# EAGLE design dimmer1 (EAGLE 8.6.3)
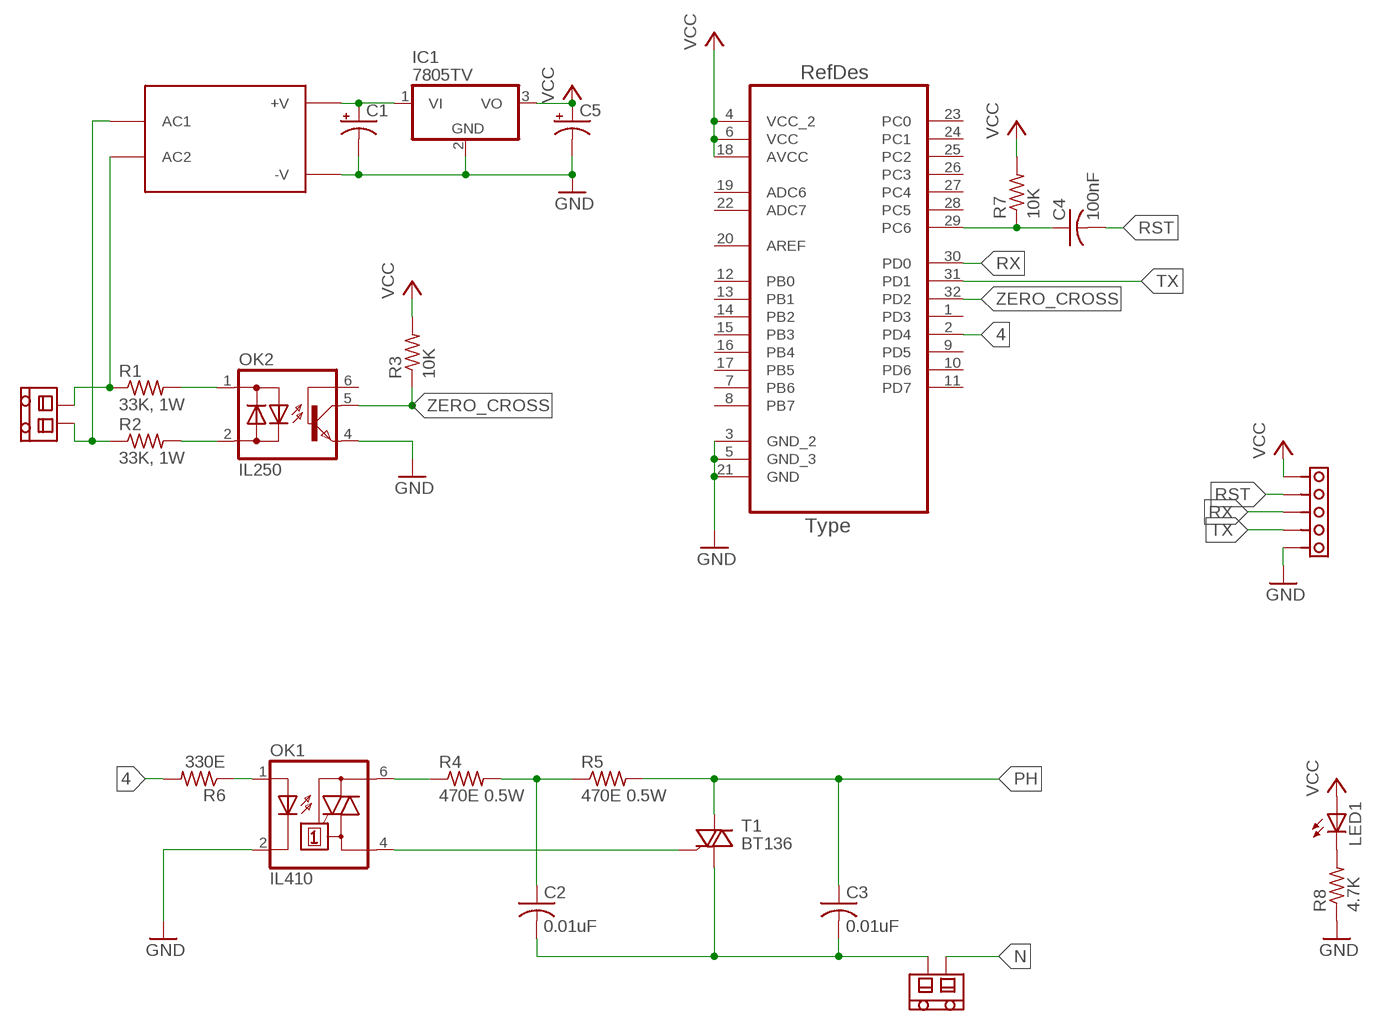
[diagram p0: schematic, sheet 1]

## Parts
C1  CPOL-US153CLV-0807  [153CLV-0807]
C2  0.01uF  C-US075-032X103  [C075-032X103]
C3  0.01uF  C-US075-032X103  [C075-032X103]
C4  100nF  C-USC1206  [C1206]
C5  CPOL-US153CLV-0807  [153CLV-0807]
IC1  7805TV  [TO220V]
LED1  LEDCHIPLED_1206  [CHIPLED_1206]
OK1  IL410  [DIL06]
OK2  IL250  [DIL06]
R1  33K, 1W  R-US_0207/10  [0207/10]
R2  33K, 1W  R-US_0207/10  [0207/10]
R3  10K  R-US_M1206  [M1206]
R4  470E 0.5W  R-US_0207/12  [0207/12]
R5  470E 0.5W  R-US_0207/12  [0207/12]
R6  330E  R-US_M1206  [M1206]
R7  10K  R-US_M1206  [M1206]
R8  4.7K  R-US_M1206  [M1206]
T1  BT136  [TO220AB]
U1  ATMEGA328P-AU  [QFP80P900X900X120-32N]
U$1  DC_ADAPTER  [DC_ADAPTER]
U$2  TERMINAL_BLOCK  [TERMINAL_BLOCK]
U$3  TERMINAL_BLOCK  [TERMINAL_BLOCK]
U$4  BERG_5  [BERG_5]

## Nets
4: R6.2 U1.2(PD4)
GND: C1.- C5.- IC1.2(GND) OK1.2(C) OK2.4(E) R8.1 U1.3(GND_2) U1.5(GND_3) U1.21(GND) U$1.V-(-V) U$4.E
N: R2.1 U$1.AC1 U$2.1 U$3.1
N$1: OK2.1(AC1) R1.2
N$2: OK1.1(A) R6.1
N$3: LED1.C R8.2
N$4: OK2.2(AC2) R2.2
N$5: C1.+ IC1.1(VI) U$1.V+(+V)
N$6: OK1.6(A2) R4.1
N$7: C2.1 R4.2 R5.1
N$8: C2.2 C3.2 T1.1(A1) U$3.2
N$9: OK1.4(A1) T1.3(G)
PH: C3.1 R1.1 R5.2 T1.2(A2) U$1.AC2 U$2.2
RS: C4.1 R7.1 U1.29(PC6)
RST: C4.2 U$4.H
RX: U1.30(PD0) U$4.G
TX: U1.31(PD1) U$4.F
VCC: C5.+ IC1.3(VO) LED1.A R3.2 R7.2 U1.4(VCC_2) U1.6(VCC) U1.18(AVCC) U$4.I
ZERO_CROSS: OK2.5(C) R3.1 U1.32(PD2)
Unconnected: OK2.6(B) U1.1(PD3) U1.7(PB6) U1.8(PB7) U1.9(PD5) U1.10(PD6) U1.11(PD7) U1.12(PB0) U1.13(PB1) U1.14(PB2) U1.15(PB3) U1.16(PB4) U1.17(PB5) U1.19(ADC6) U1.20(AREF) U1.22(ADC7) U1.23(PC0) U1.24(PC1) U1.25(PC2) U1.26(PC3) U1.27(PC4) U1.28(PC5)

## Library data of the parts
C1 C5 = rcl:CPOL-US: POLARIZED CAPACITOR, American symbol; SPICEPREFIX: C
C2-C4 = rcl:C-US: CAPACITOR, American symbol; SPICEPREFIX: C
IC1 = linear:78*: Positive VOLTAGE REGULATOR Source: http://cache.national.com/ds/LM/LM78L05.pdf http://www.fairchildsemi.com/ds/LM/LM7805.pdf
LED1 = led:LED: LED OSRAM: - CHIPLED LG R971, LG N971, LY N971, LG Q971, LY Q971, LO R971, LY R971 LH N974, LH R974 LS Q976, LO Q976, LY Q976 LO Q996 - Hyper CHIPLED LW Q18S LB Q993, LB Q99A, LB R99A - SideLED LS A670, LO A670, LY A670, LG A670, LP A670 LB A673, LV A673, LT A673, LW A673 LH A674 LY A675 LS A676, LA A676, LO A676, LY A676, LW A676 LS A679, LY A679, LG A679 - Hyper Micro SIDELED® LS Y876, LA Y876, LO Y876, LY Y876 LT Y87S - SmartLED LW L88C, LW L88S LB L89C, LB L89S, LG L890 LS L89K, LO L89K, LY L89K LS L896, LA L896, LO L896, LY L896 - TOPLED LS T670, LO T670, LY T670, LG T670, LP T670 LSG T670, LSP T670, LSY T670, LOP T670, LYG T670 LG T671, LOG T671, LSG T671 LB T673, LV T673, LT T673, LW T673 LH T674 LS T676, LA T676, LO T676, LY T676, LB T676, LH T676, LSB T676, LW T676 LB T67C, LV T67C, LT T67C, LS T67K, LO T67K, LY T67K, LW E67C LS E67B, LA E67B, LO E67B, LY E67B, LB E67C, LV E67C, LT E67C LW T67C LS T679, LY T679, LG T679 LS T770, LO T770, LY T770, LG T770, LP T770 LB T773, LV T773, LT T773, LW T773 LH T774 LS E675, LA E675, LY E675, LS T675 LS T776, LA T776, LO T776, LY T776, LB T776 LHGB T686 LT T68C, LB T68C - Hyper Mini TOPLED® LB M676 - Mini TOPLED Santana® LG M470 LS M47K, LO M47K, LY M47K Source: http://www.osram.convergy.de LUXEON: - LUMILED® LXK2-PW12-R00, LXK2-PW12-S00, LXK2-PW14-U00, LXK2-PW14-V00 LXK2-PM12-R00, LXK2-PM12-S00, LXK2-PM14-U00 LXK2-PE12-Q00, LXK2-PE12-R00, LXK2-PE12-S00, LXK2-PE14-T00, LXK2-PE14-U00 LXK2-PB12-K00, LXK2-PB12-L00, LXK2-PB12-M00, LXK2-PB14-N00, LXK2-PB14-P00, LXK2-PB14-Q00 LXK2-PR12-L00, LXK2-PR12-M00, LXK2-PR14-Q00, LXK2-PR14-R00 LXK2-PD12-Q00, LXK2-PD12-R00, LXK2-PD12-S00 LXK2-PH12-R00, LXK2-PH12-S00 LXK2-PL12-P00, LXK2-PL12-Q00, LXK2-PL12-R00 Source: www.luxeon.com KINGBRIGHT: KA-3528ASYC Source: www.kingbright.com
OK1 = optocoupler:IL410: SIEMENS OPTO COUPLER; MF: VISHAY/TELEFUNKEN; MPN: IL410; OC_FARNELL: 1045434; OC_NEWARK: 58K1715
OK2 = optocoupler:IL250: SIEMENS OPTO COUPLER; MF: VISHAY/TELEFUNKEN; MPN: IL250; OC_FARNELL: 1469559; OC_NEWARK: 58K1705
R1-R8 = rcl:R-US_: RESISTOR, American symbol; SPICEPREFIX: R
T1 = triac:BT136: Triac BT136 series E sensitive gate Source: http://www.nxp.com/acrobat_download/datasheets/BT136_SERIES_E_2.pdf
U1 = ATmega328-AU:ATMEGA328P-AU; DESCRIPTION: 8-bit Microcontroller with In-System Programmable Flash; MPN: ATMEGA328P-AU; OC_FARNELL: 1715486; OC_NEWARK: 14R4631; PACKAGE: TQFP-32; SUPPLIER: Atmel
U$1 = dragCustom:DC_ADAPTER
U$2 U$3 = dragCustom:TERMINAL_BLOCK
U$4 = dragCustom:BERG_5

## Board
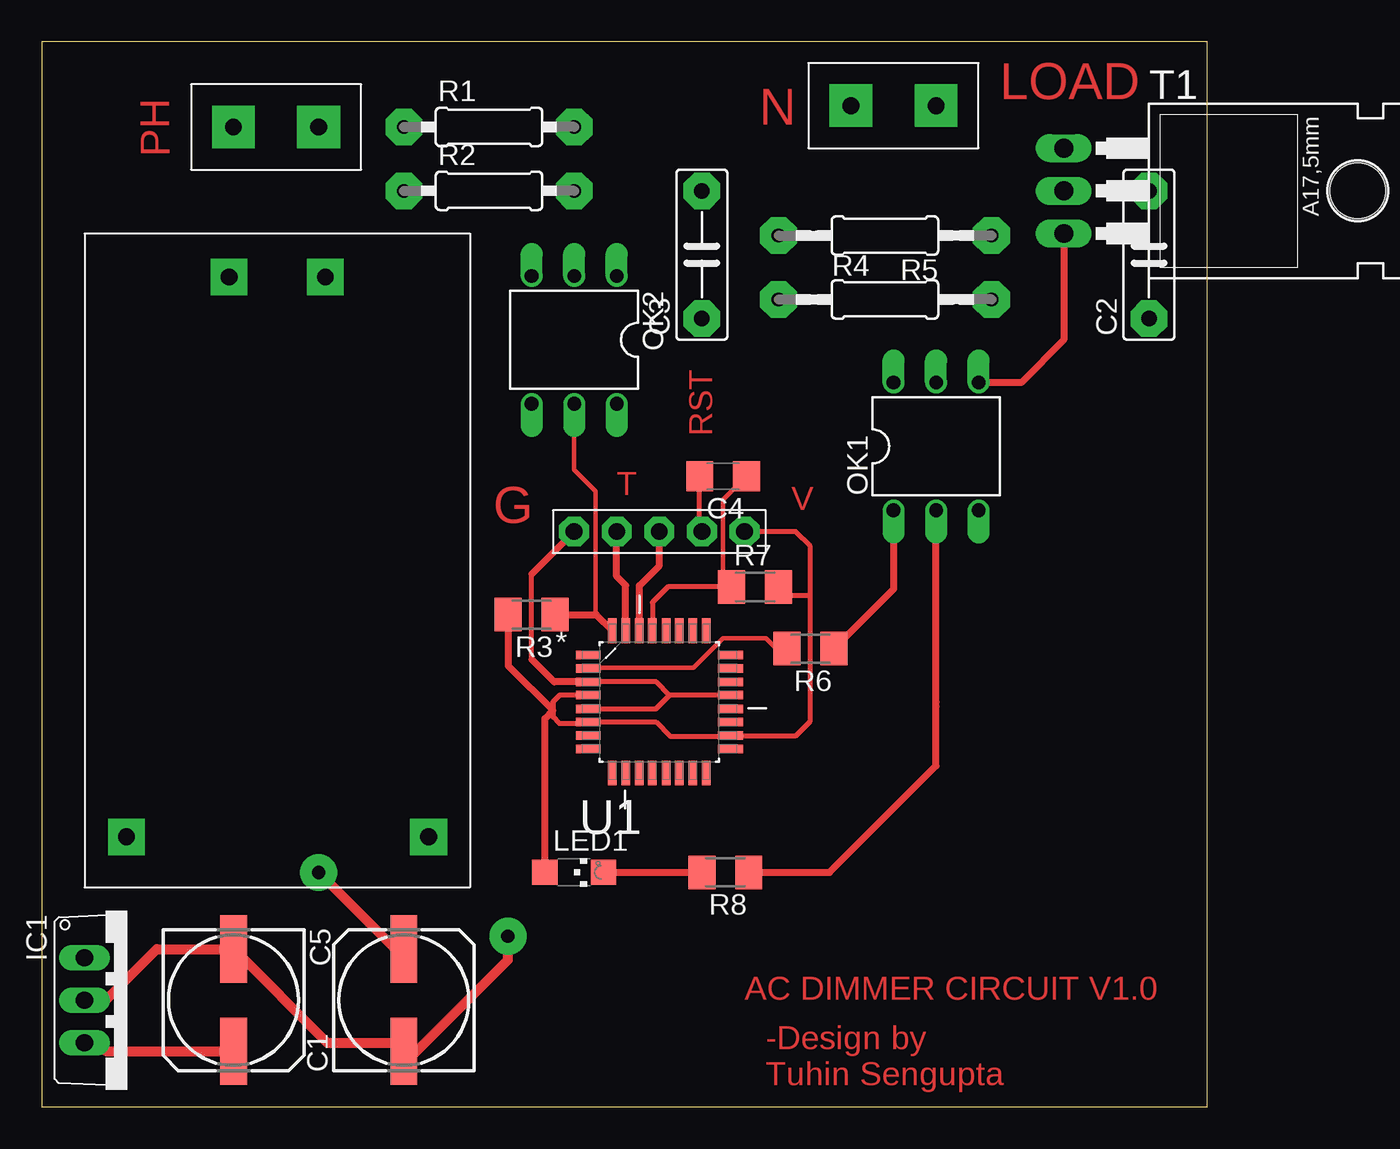
[diagram p1: board, top side]
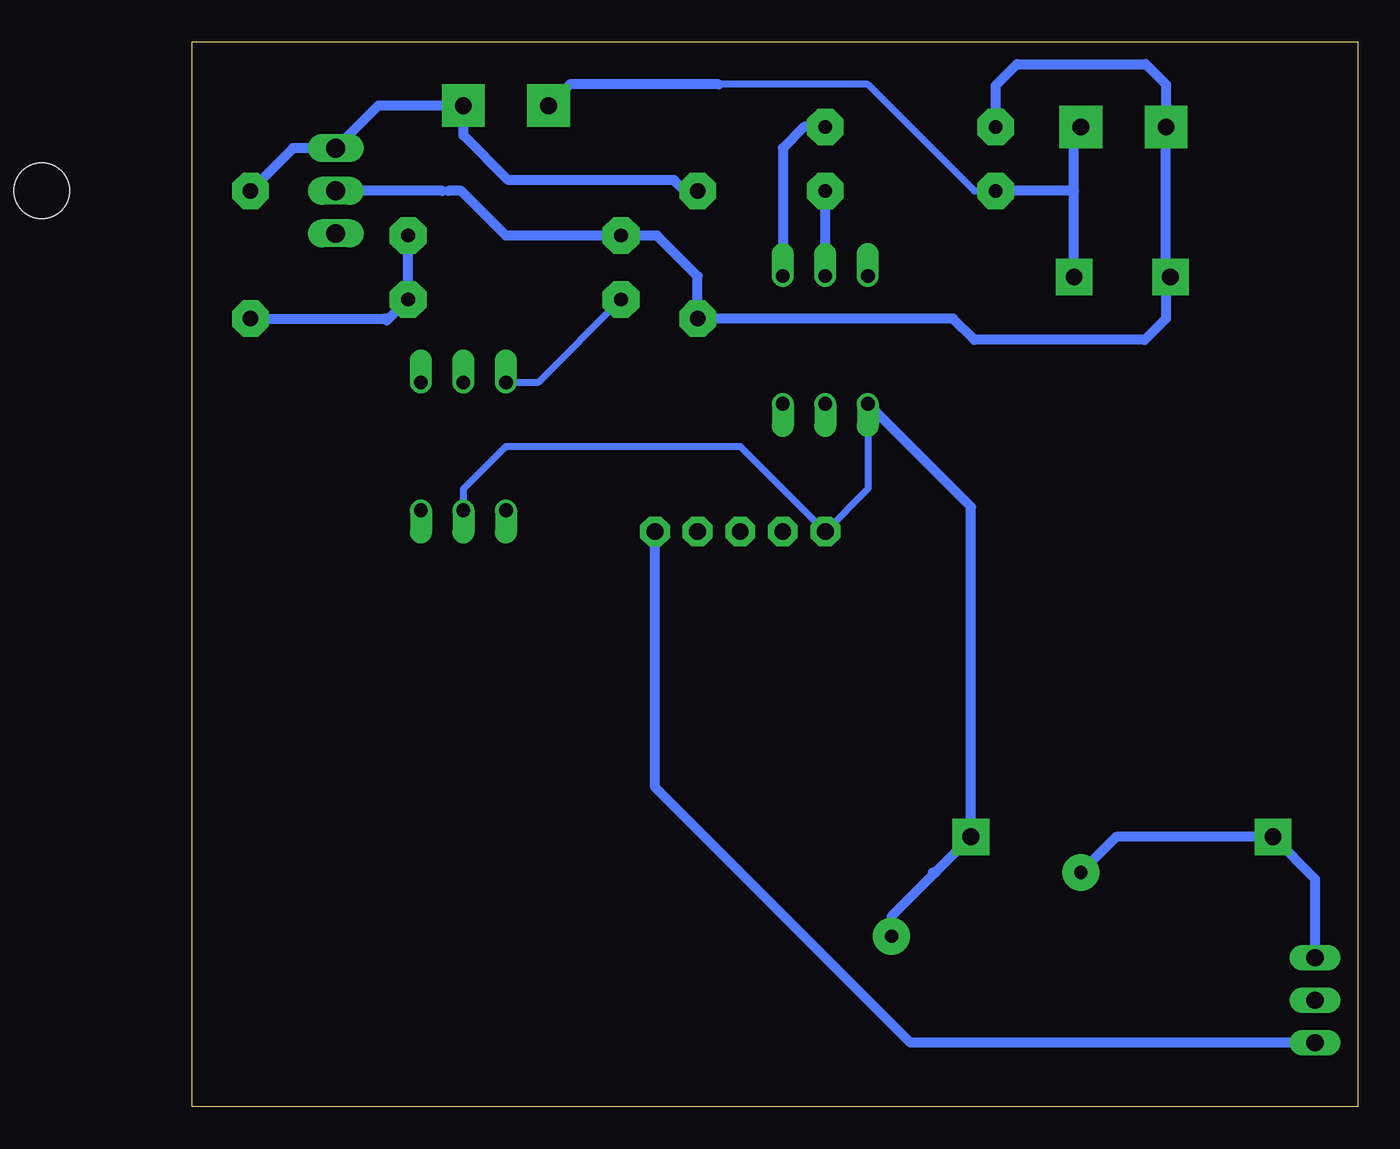
[diagram p2: board, bottom side, seen from below]

Size 69.52 x 63.49 mm. Coordinates in mm from the lower left corner, seen from the top.
Outline: 0,0 69.52,0 69.52,63.49 0,63.49 0,0
Copper layers (1*16): Top 0.035mm / dielectric 1.5mm / Bottom 0.035mm
Design rules "default": minimum track width 6mil, minimum drill 0.35mm, track to track 6mil, track to pad 6mil, pad to pad 6mil, via to via 6mil, smd to smd 6mil, copper to edge 40mil, drill to drill 6mil, minimum pad ring 10mil, minimum via ring 8mil, stop-mask expansion 4mil, vias tented up to drill 0mil, thermal gap 10mil

### Footprints (pad centres in the part's own frame; a part is rotated, then mirrored left to right if it is on the bottom)
153CLV-0807 = smd 4 x 1.6: + 3.05,0; - -3.05,0
C075-032X103 = drill 0.914 pad 2.184 octagon: 1 -3.81,0; 2 3.81,0
C1206 = smd 1.6 x 1.8: 1 -1.4,0; 2 1.4,0
TO220V = drill 1.016 long: 1 -2.54,-2.54; 2 0,-2.54; 3 2.54,-2.54
CHIPLED_1206 = smd 1.5 x 1.5: A 0,-1.75; C 0,1.75
DIL06 = drill 0.813 offset: 1 -2.54,-3.81; 2 0,-3.81; 3 2.54,-3.81; 4 2.54,3.81; 5 0,3.81; 6 -2.54,3.81
0207/10 = drill 0.813 pad 2.184 octagon: 1 -5.08,0; 2 5.08,0
M1206 = smd 1.6 x 2: 1 -1.4,0; 2 1.4,0
0207/12 = drill 0.813 pad 2.184 octagon: 1 -6.35,0; 2 6.35,0
TO220AB = drill 1.118 long: 1 -2.54,-6.35; 2 0,-6.35; 3 2.54,-6.35 | hole 3.302: 0,11.176
QFP80P900X900X120-32N = smd 1.473 x 0.508: 1 -4.242,2.794; 2 -4.242,2.007; 3 -4.242,1.194; 4 -4.242,0.406; 5 -4.242,-0.406; 6 -4.242,-1.194; 7 -4.242,-2.007; 8 -4.242,-2.794; 17 4.242,-2.794; 18 4.242,-2.007; 19 4.242,-1.194; 20 4.242,-0.406; 21 4.242,0.406; 22 4.242,1.194; 23 4.242,2.007; 24 4.242,2.794 | smd 0.508 x 1.473: 9 -2.794,-4.242; 10 -2.007,-4.242; 11 -1.194,-4.242; 12 -0.406,-4.242; 13 0.406,-4.242; 14 1.194,-4.242; 15 2.007,-4.242; 16 2.794,-4.242; 25 2.794,4.242; 26 2.007,4.242; 27 1.194,4.242; 28 0.406,4.242; 29 -0.406,4.242; 30 -1.194,4.242; 31 -2.007,4.242; 32 -2.794,4.242
DC_ADAPTER = drill 1 pad 2.184 square: AC1 -17.72,4.215; AC2 -17.72,-1.534; V+ 15.665,-7.66; V- 15.665,10.365
TERMINAL_BLOCK = drill 1 pad 2.54 square: 1 -2.54,0; 2 2.54,0
BERG_5 = drill 1 pad 1.778 octagon: E 0,5.08; F 0,2.54; G 0,0; H 0,-2.54; I 0,-5.08

### Placement (x,y rotation side)
C1  21.59,6.35 90 top
C2  66.04,50.8 90 top
C3  39.37,50.8 90 top
C4  40.64,37.59 180 top
C5  11.43,6.35 270 top
IC1  5.08,6.35 270 top
LED1  31.75,13.97 270 top
OK1  53.34,39.37 0 top
OK2  31.75,45.72 180 top
R1  26.67,58.42 0 top
R2  26.67,54.61 0 top
R3  29.21,29.34 180 top
R4  50.29,48.13 0 top
R5  50.29,51.94 180 top
R6  45.85,27.3 180 top
R7  42.55,30.99 0 top
R8  40.77,13.97 180 top
T1  67.31,54.61 270 top
U1  36.83,24.13 0 top
U$1  12.7,31.75 270 top
U$2  13.97,58.42 180 top
U$3  50.8,59.69 0 top
U$4  36.83,34.29 90 top

### Tracks (layer width: path | path; a pad name or v marks a point on that pad's centre or on a via)
4
  Top 0.254: R6.2 43.81,27.3 43.18,27.94 40.64,27.94 38.86,26.16 32.61,26.16 U1.2
GND  (via drill 0.8 pad 2.18)
  Top 0.305: U1.21 37.44,24.54 | U1.3 36.65,25.32 37.44,24.54 | U1.5 36.63,23.72 37.44,24.54 | 29.21,26.67 29.21,31.75
  Top 0.406: U1.3 30.56,25.32 29.21,26.67 | 29.21,31.75 U$4.E | OK1.2 53.34,24.13 53.34,23.87 53.34,20.32 46.99,13.97 R8.1
  Top 0.61: IC1.2 3.81,6.35 6.86,9.4 C5.- 17.02,3.81 21.08,3.81 C1.- 21.59,2.54 27.81,8.76 v27.81,10.16
  Bottom 0.406: OK2.4 29.21,36.83 U$4.E 36.83,39.37 50.8,39.37 53.34,36.83 OK1.2
  Bottom 0.61: 25.18,13.97 U$1.V- 23.07,35.77 OK2.4 | 25.18,13.97 25.34,13.97 | 25.18,13.97 27.81,11.34 v27.81,10.16
N
  Bottom 0.406: 38.1,60.96 29.21,60.96 22.86,54.61 R2.1
  Bottom 0.61: U$2.1 16.91,58.01 16.91,54.61 | U$1.AC1 16.91,54.61 | 16.91,54.61 R2.1 | U$3.1 46.99,60.96 38.1,60.96
N$1
  Bottom 0.61: R1.2 33.02,58.42 34.29,57.15 OK2.1
N$2
  Top 0.406: OK1.1 50.8,30.86 R6.1
N$3
  Top 0.406: LED1.C R8.2
N$4
  Bottom 0.61: OK2.2 R2.2
N$5  (via drill 0.8 pad 2.18)
  Top 0.61: v16.51,13.97 21.08,9.4 C1.+
  Bottom 0.61: v16.51,13.97 14.39,16.09 U$1.V+ 2.54,13.59 IC1.1
N$6
  Bottom 0.406: R4.1 48.9,43.18 OK1.6
N$7
  Bottom 0.406: 57.91,46.86 58.42,46.87 | 58.42,46.87 C2.1 | R4.2 57.9,46.87 58.42,46.87
  Bottom 0.61: R5.1 R4.2 57.91,46.86 58.04,46.99 C2.1
N$8
  Bottom 0.61: U$3.2 58.42,59.69 T1.1 63.5,57.15 C2.2 | 53.34,58.42 U$3.2 | C3.2 40.13,54.61 40.77,55.24 50.67,55.24 53.34,57.91 U$3.2
N$9
  Top 0.406: T1.3 60.96,45.72 58.42,43.18 OK1.4
PH
  Bottom 0.406: 54.23,54.61 54.61,54.61
  Bottom 0.61: R1.1 21.59,60.9 20.32,62.17 12.64,62.17 11.43,60.96 U$2.2 11.43,49.73 U$1.AC2 11.43,49.21 11.43,46.99 12.7,45.72 22.86,45.72 24.13,46.99 C3.1 39.37,49.53 41.78,51.94 R5.2 50.8,51.94 53.47,54.61 54.23,54.61 | 54.61,54.61 T1.2
RS
  Top 0.254: C4.1 40.64,36.19 40.64,31.37 41.02,30.99
  Top 0.305: R7.1 41.02,30.99 37.34,30.99 36.42,30.07 U1.29
RST
  Top 0.305: U$4.H 39.24,34.42 C4.2
RX
  Top 0.406: U1.30 35.64,31.06 36.83,32.26 U$4.G
TX
  Top 0.406: U1.31 34.82,31.09 34.29,31.62 U$4.F
VCC
  Top 0.305: U$4.I 44.96,34.29 45.85,33.4 45.85,30.48 | 45.85,30.48 45.85,22.99 44.98,22.12 U1.18 41.05,22.1 37.47,22.1 36.63,22.94 U1.6 32.51,22.86 30.86,22.86 30.48,23.24 30.48,23.62 30.48,24.13 30.89,24.54 U1.4 | R7.2 44.45,30.48 45.85,30.48
  Top 0.406: R3.2 27.81,26.29 30.48,23.62 30,23.14 LED1.A
  Top 0.61: IC1.3 3.3,3.81 3.81,3.3 C5.+
  Bottom 0.61: IC1.3 26.67,3.81 41.91,19.05 U$4.I
ZERO_CROSS
  Top 0.254: U1.32 33.02,29.39 33.02,36.7 31.75,37.97 OK2.5
  Top 0.406: R3.1 33.07,29.34 U1.32

### Text on the board
Top: LOAD | N | PH | RST | T | V | G | AC DIMMER CIRCUIT V1.0 | -Design by / Tuhin Sengupta